# EAGLE design v1 (EAGLE 9.6.2)
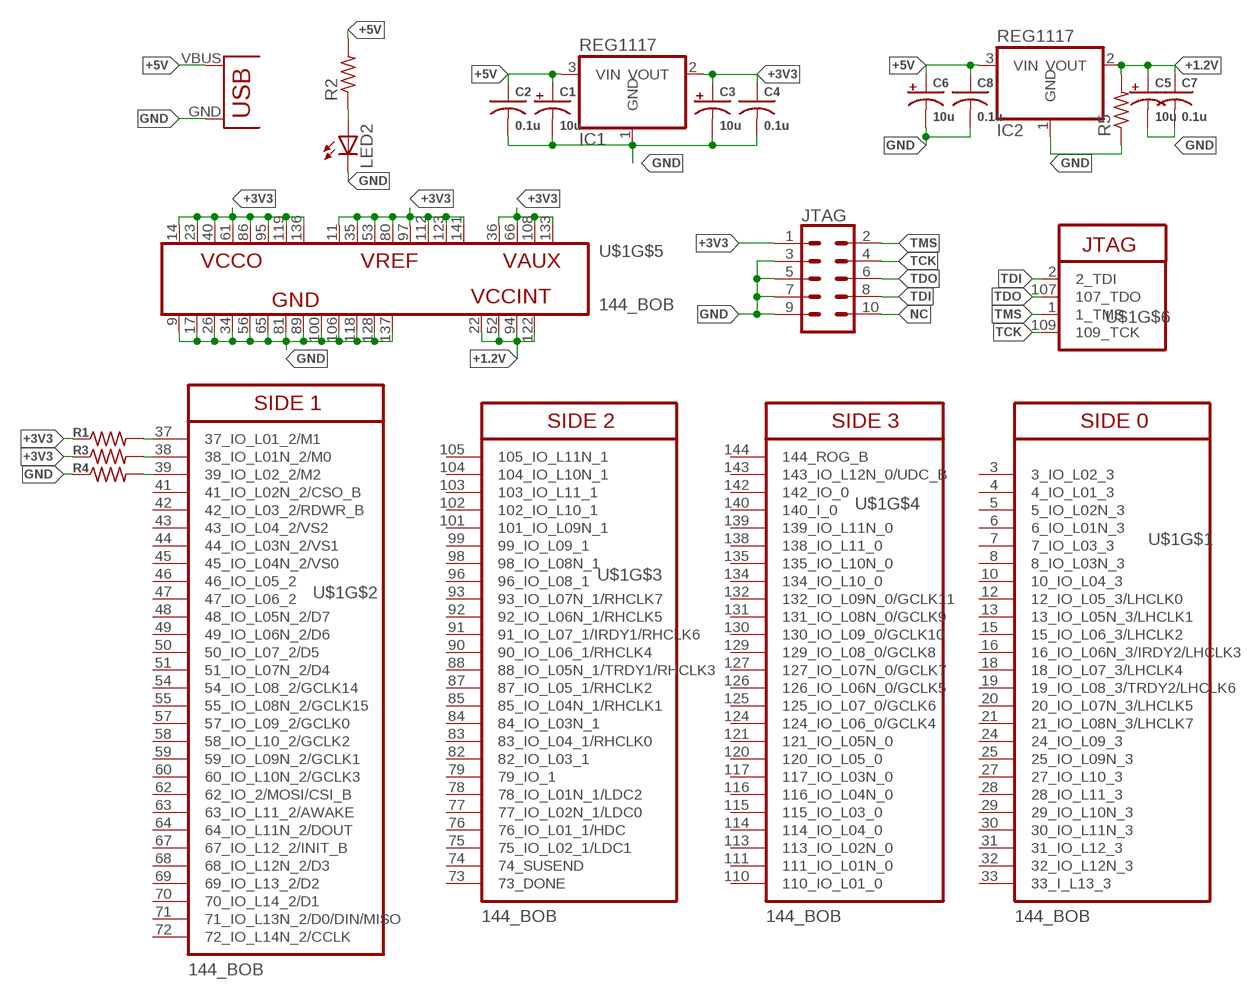
[diagram p0: schematic, sheet 1]

## Parts
C1  10u  CAP_POL_16V  [B/3528-21R]
C2  0.1u  CAP0603  [C0603]
C3  10u  CAP_POL_16V  [B/3528-21R]
C4  0.1u  CAP0603  [C0603]
C5  10u  CAP_POL_16V  [B/3528-21R]
C6  10u  CAP_POL_16V  [B/3528-21R]
C7  0.1u  CAP0603  [C0603]
C8  0.1u  CAP0603  [C0603]
IC1  REG1117  [SOT223]
IC2  REG1117  [SOT223]
JTAG  CONN_05X2  [2X5-SHROUDED_LOCK_PROPER]
LED2  LED3MM  [LED3MM]
R1  RESISTOR0805  [R0805]
R2  R-US_0204/7  [0204/7]
R3  RESISTOR0805  [R0805]
R4  RESISTOR0805  [R0805]
R5  R-US_0204/7  [0204/7]
U$1  144_BOB  [144_BOB]
U$2  USB(POWER)  [USB(POWER)]

## Nets
+1.2V: C5.+ C7.1 IC2.2(VOUT) R5.2 U$1.22(22_VCCINT) U$1.52(52_VCCINT) U$1.94(94_VCCINT) U$1.122(122_VCCINT)
+3V3: C3.+ C4.1 IC1.2(VOUT) JTAG.1 R1.1 R3.1 U$1.11(11_VREF) U$1.14(14_VCCO) U$1.23(23_VCCO) U$1.35(35_VREF) U$1.36(36_VAUX) U$1.40(40_VCCO) U$1.53(53_VREF) U$1.61(61_VCCO) U$1.66(66_VAUX) U$1.80(80_VREF) U$1.86(86_VCCO) U$1.95(95_VCCO) U$1.97(97_VREF) U$1.108(108_VAUX) U$1.112(112_VREF) U$1.119(119_VCCO) U$1.123(123_VREF) U$1.133(133_VAUX) U$1.136(136_VCCO) U$1.141(141_VREF)
+5V: C1.+ C2.1 C6.+ C8.1 IC1.3(VIN) IC2.3(VIN) R2.2 U$2.VBUS(VCC)
GND: C1.- C2.2 C3.- C4.2 C5.- C6.- C7.2 C8.2 IC1.1(GND) IC2.1(GND) JTAG.3 JTAG.5 JTAG.7 JTAG.9 LED2.K(C) R4.1 R5.1 U$1.9(9_GND) U$1.17(17_GND) U$1.26(26_GND) U$1.34(34_GND) U$1.56(56_GND) U$1.65(65_GND) U$1.81(81_GND) U$1.89(89_GND) U$1.100(100_GND) U$1.106(106_GND) U$1.118(118_GND) U$1.128(128_GND) U$1.137(137_GND) U$2.GND
N$5: R1.2 U$1.37(37_IO_L01_2/M1)
N$6: LED2.A R2.1
N$7: R3.2 U$1.38(38_IO_L01N_2/M0)
N$8: R4.2 U$1.39(39_IO_L02_2/M2)
NC: JTAG.10
TCK: JTAG.4 U$1.109(109_TCK)
TDI: JTAG.8 U$1.2(2_TDI)
TDO: JTAG.6 U$1.107(107_TDO)
TMS: JTAG.2 U$1.1(1_TMS)
Unconnected: U$1.3(3_IO_L02_3) U$1.4(4_IO_L01_3) U$1.5(5_IO_L02N_3) U$1.6(6_IO_L01N_3) U$1.7(7_IO_L03_3) U$1.8(8_IO_L03N_3) U$1.10(10_IO_L04_3) U$1.12(12_IO_L05_3/LHCLK0) U$1.13(13_IO_L05N_3/LHCLK1) U$1.15(15_IO_L06_3/LHCLK2) U$1.16(16_IO_L06N_3/IRDY2/LHCLK3) U$1.18(18_IO_L07_3/LHCLK4) U$1.19(19_IO_L08_3/TRDY2/LHCLK6) U$1.20(20_IO_L07N_3/LHCLK5) U$1.21(21_IO_L08N_3/LHCLK7) U$1.24(24_IO_L09_3) U$1.25(25_IO_L09N_3) U$1.27(27_IO_L10_3) U$1.28(28_IO_L11_3) U$1.29(29_IO_L10N_3) U$1.30(30_IO_L11N_3) U$1.31(31_IO_L12_3) U$1.32(32_IO_L12N_3) U$1.33(33_I_L13_3) U$1.41(41_IO_L02N_2/CSO_B) U$1.42(42_IO_L03_2/RDWR_B) U$1.43(43_IO_L04_2/VS2) U$1.44(44_IO_L03N_2/VS1) U$1.45(45_IO_L04N_2/VS0) U$1.46(46_IO_L05_2) U$1.47(47_IO_L06_2) U$1.48(48_IO_L05N_2/D7) U$1.49(49_IO_L06N_2/D6) U$1.50(50_IO_L07_2/D5) U$1.51(51_IO_L07N_2/D4) U$1.54(54_IO_L08_2/GCLK14) U$1.55(55_IO_L08N_2/GCLK15) U$1.57(57_IO_L09_2/GCLK0) U$1.58(58_IO_L10_2/GCLK2) U$1.59(59_IO_L09N_2/GCLK1) U$1.60(60_IO_L10N_2/GCLK3) U$1.62(62_IO_2/MOSI/CSI_B) U$1.63(63_IO_L11_2/AWAKE) U$1.64(64_IO_L11N_2/DOUT) U$1.67(67_IO_L12_2/INIT_B) U$1.68(68_IO_L12N_2/D3) U$1.69(69_IO_L13_2/D2) U$1.70(70_IO_L14_2/D1) U$1.71(71_IO_L13N_2/D0/DIN/MISO) U$1.72(72_IO_L14N_2/CCLK) U$1.73(73_DONE) U$1.74(74_SUSEND) U$1.75(75_IO_L02_1/LDC1) U$1.76(76_IO_L01_1/HDC) U$1.77(77_IO_L02N_1/LDC0) U$1.78(78_IO_L01N_1/LDC2) U$1.79(79_IO_1) U$1.82(82_IO_L03_1) U$1.83(83_IO_L04_1/RHCLK0) U$1.84(84_IO_L03N_1) U$1.85(85_IO_L04N_1/RHCLK1) U$1.87(87_IO_L05_1/RHCLK2) U$1.88(88_IO_L05N_1/TRDY1/RHCLK3) U$1.90(90_IO_L06_1/RHCLK4) U$1.91(91_IO_L07_1/IRDY1/RHCLK6) U$1.92(92_IO_L06N_1/RHCLK5) U$1.93(93_IO_L07N_1/RHCLK7) U$1.96(96_IO_L08_1) U$1.98(98_IO_L08N_1) U$1.99(99_IO_L09_1) U$1.101(101_IO_L09N_1) U$1.102(102_IO_L10_1) U$1.103(103_IO_L11_1) U$1.104(104_IO_L10N_1) U$1.105(105_IO_L11N_1) U$1.110(110_IO_L01_0) U$1.111(111_IO_L01N_0) U$1.113(113_IO_L02N_0) U$1.114(114_IO_L04_0) U$1.115(115_IO_L03_0) U$1.116(116_IO_L04N_0) U$1.117(117_IO_L03N_0) U$1.120(120_IO_L05_0) U$1.121(121_IO_L05N_0) U$1.124(124_IO_L06_0/GCLK4) U$1.125(125_IO_L07_0/GCLK6) U$1.126(126_IO_L06N_0/GCLK5) U$1.127(127_IO_L07N_0/GCLK7) U$1.129(129_IO_L08_0/GCLK8) U$1.130(130_IO_L09_0/GCLK10) U$1.131(131_IO_L08N_0/GCLK9) U$1.132(132_IO_L09N_0/GCLK11) U$1.134(134_IO_L10_0) U$1.135(135_IO_L10N_0) U$1.138(138_IO_L11_0) U$1.139(139_IO_L11N_0) U$1.140(140_I_0) U$1.142(142_IO_0) U$1.143(143_IO_L12N_0/UDC_B) U$1.144(144_ROG_B)

## Library data of the parts
C1 C3 C5 C6 = CEDT_JANUARY_2015_v5:CAP_POL
C2 C4 C7 C8 = CEDT_JANUARY_2015_v5:CAP
IC1 IC2 = CEDT_JANUARY_2015_v5:REG1117: 800mA and 1A Low Dropout (LDO) Positive Regulator 1.8V, 2.5V, 2.85V, 3.3V, 5V, and Adj
JTAG = SparkFun-Connectors_v3:CONN_05X2: Multi connection point. Often used as Generic Header-pin footprint for 0.1 inch spaced/style header connections For AVR SPI programming port, see special device with nice symbol: "AVR_SPI_PROG_5x2.dev" You can populate with any combo of single row headers, but if you'd like an exact match, check these: 2x5 AVR ICSP Male Header <https://www.sparkfun.com/products/778> (PRT-00778) 2x5 Pin Shrouded Header <https://www.sparkfun.com/products/8506> (PRT-08506) On any of the 0.1 inch spaced packages, you can populate with these: Break Away Headers - Straight <https://www.sparkfun.com/products/116> (PRT-00116) Break Away Male Headers - Right Angle <https://www.sparkfun.com/products/553> (PRT-00553) Female Headers <https://www.sparkfun.com/products/115> (PRT-00115) Break Away Headers - Machine Pin <https://www.sparkfun.com/products/117> (PRT-00117) Break Away Female Headers - Swiss Machine Pin <https://www.sparkfun.com/products/743> (PRT-00743) Special note: the shrouded connector mates well with our 5x2 ribbon cables: 2x5 Pin IDC Ribbon Cable <https://www.sparkfun.com/products/8535> (PRT-08535)
LED2 = CEDT_JANUARY_2015_v5:LED
R1 R3 R4 = CEDT_JANUARY_2015_v5:RESISTOR
R2 R5 = rcl:R-US_: RESISTOR, American symbol; SPICEPREFIX: R
U$1 = Suprio_Lib:144_BOB
U$2 = CEDT_JANUARY_2015_v5:USB(POWER)

## Net classes
0 default: width 0.406 mm
1 POWER: width 0.406 mm

## Board
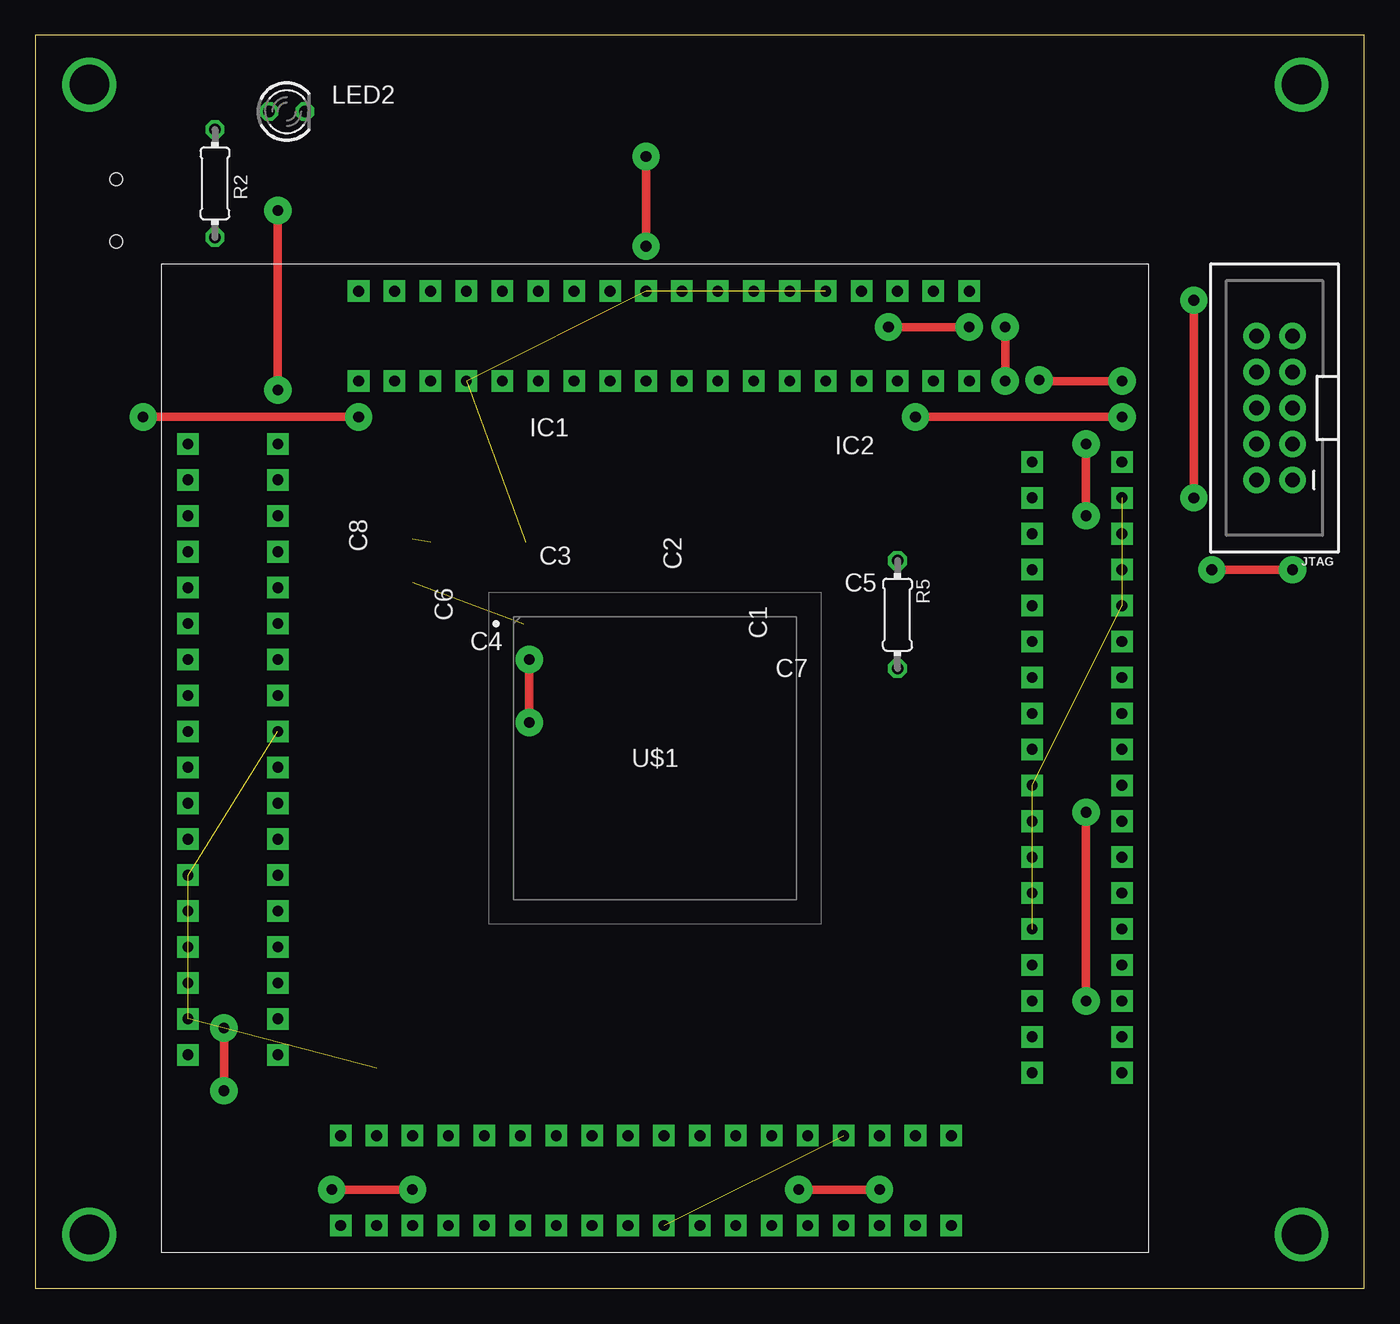
[diagram p1: board, top side]
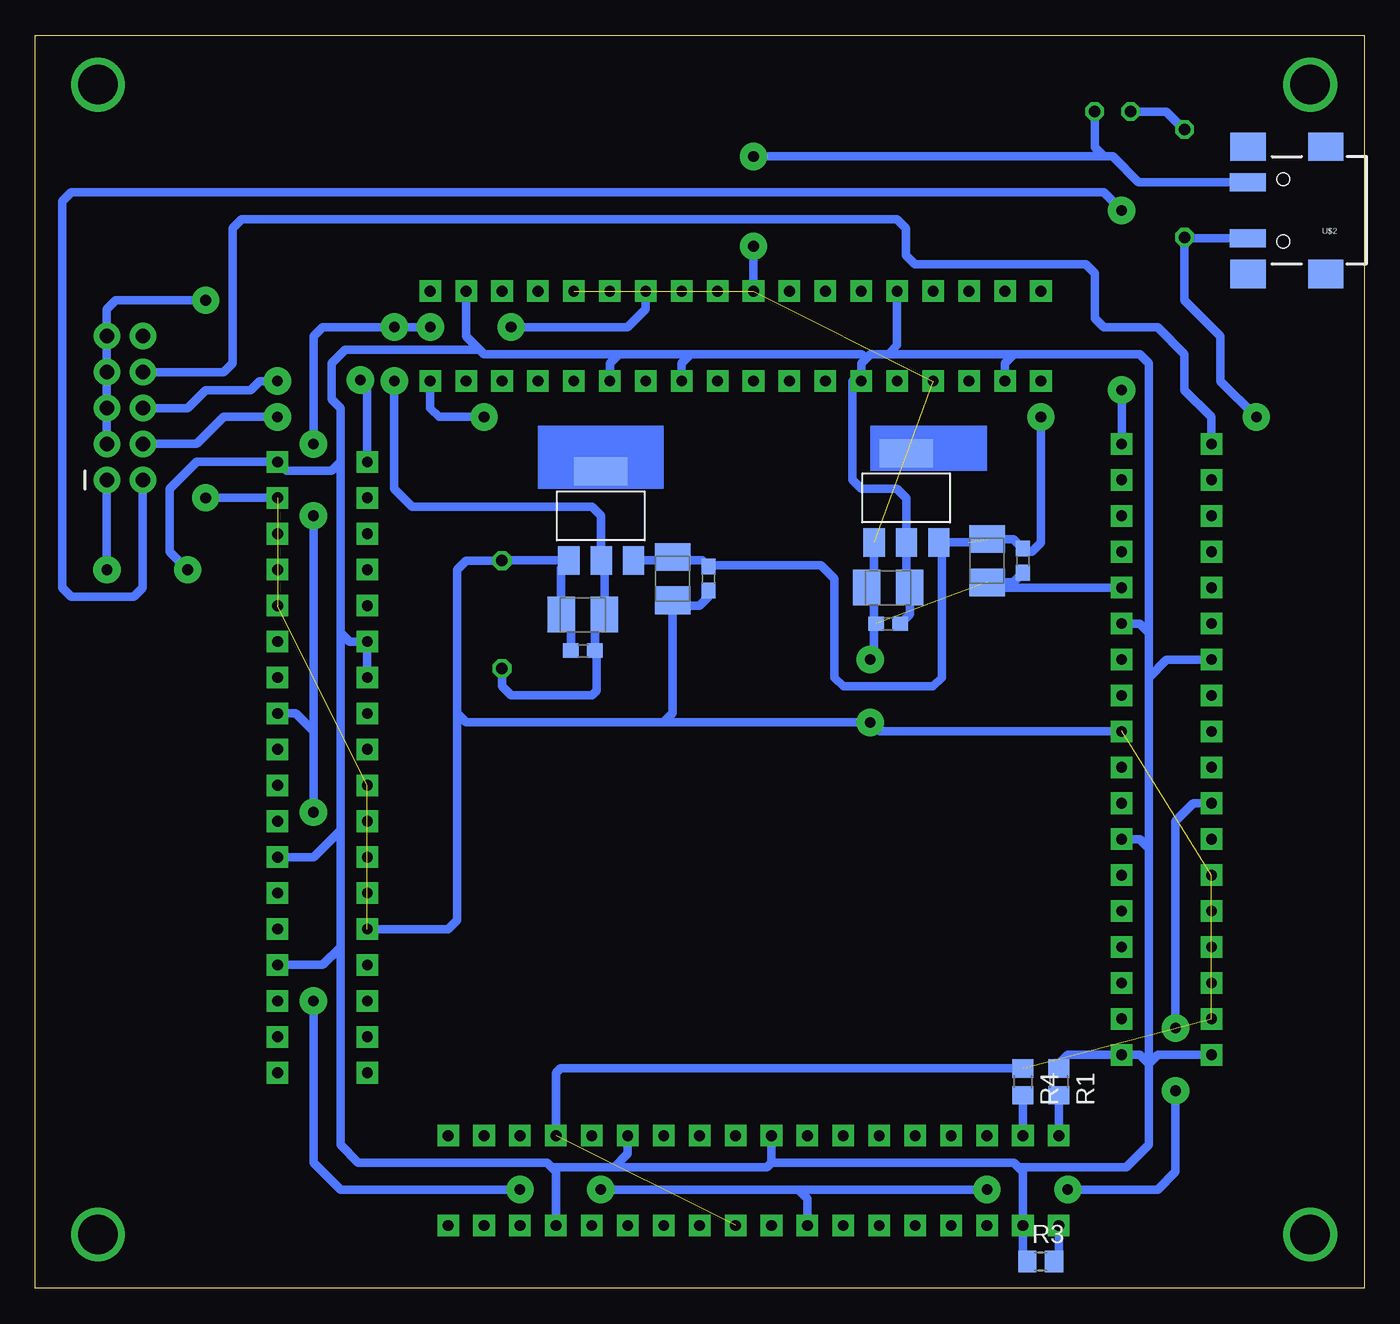
[diagram p2: board, bottom side, seen from below]

Size 93.96 x 88.57 mm. Coordinates in mm from the lower left corner, seen from the top.
Outline: 0,0 93.96,0 93.96,88.57 0,88.57 0,0
Copper layers (1*16): Top 0.035mm / dielectric 1.5mm / Bottom 0.035mm
Design rules "default": minimum track width 6mil, minimum drill 0.35mm, track to track 6mil, track to pad 6mil, pad to pad 6mil, via to via 6mil, smd to smd 6mil, copper to edge 40mil, drill to drill 6mil, minimum pad ring 10mil, minimum via ring 8mil, stop-mask expansion 4mil, vias tented up to drill 0mil, thermal gap 10mil

### Footprints (pad centres in the part's own frame; a part is rotated, then mirrored left to right if it is on the bottom)
B/3528-21R = smd 1.95 x 2.5: + 1.525,0; - -1.525,0
C0603 = smd 1.1 x 1: 1 -0.85,0; 2 0.85,0
SOT223 = smd 1.499 x 2.007: 1 -2.261,-3.15; 2 0.025,-3.15; 3 2.311,-3.15 | smd 3.81 x 2.007: 4 0,3.15
2X5-SHROUDED_LOCK_PROPER = drill 1.016 pad 1.88: 1 -1.27,5.08; 2 1.27,5.08; 3 -1.27,2.54; 4 1.27,2.54; 5 -1.27,0; 6 1.27,0; 7 -1.27,-2.54; 8 1.27,-2.54; 9 -1.27,-5.08; 10 1.27,-5.08
LED3MM = drill 0.813 octagon: A -1.27,0; K 1.27,0
R0805 = smd 1.3 x 1.5: 1 -0.95,0; 2 0.95,0
0204/7 = drill 0.813 octagon: 1 -3.81,0; 2 3.81,0
144_BOB = drill 0.762 pad 1.524 square: 1 -26.67,21.59; 2 -33.02,21.59; 3 -26.67,19.05; 4 -33.02,19.05; 5 -26.67,16.51; 6 -33.02,16.51; 7 -26.67,13.97; 8 -33.02,13.97; 9 -26.67,11.43; 10 -33.02,11.43; 11 -26.67,8.89; 12 -33.02,8.89; 13 -26.67,6.35; 14 -33.02,6.35; 15 -26.67,3.81; 16 -33.02,3.81; 17 -26.67,1.27; 18 -33.02,1.27; 19 -26.67,-1.27; 20 -33.02,-1.27; 21 -26.67,-3.81; 22 -33.02,-3.81; 23 -26.67,-6.35; 24 -33.02,-6.35; 25 -26.67,-8.89; 26 -33.02,-8.89; 27 -26.67,-11.43; 28 -33.02,-11.43; 29 -26.67,-13.97; 30 -33.02,-13.97; 31 -26.67,-16.51; 32 -33.02,-16.51; 33 -26.67,-19.05; 34 -33.02,-19.05; 35 -26.67,-21.59; 36 -33.02,-21.59; 37 -22.225,-27.305; 38 -22.225,-33.655; 39 -19.685,-27.305; 40 -19.685,-33.655; 41 -17.145,-27.305; 42 -17.145,-33.655; 43 -14.605,-27.305; 44 -14.605,-33.655; 45 -12.065,-27.305; 46 -12.065,-33.655; 47 -9.525,-27.305; 48 -9.525,-33.655; 49 -6.985,-27.305; 50 -6.985,-33.655; 51 -4.445,-27.305; 52 -4.445,-33.655; 53 -1.905,-27.305; 54 -1.905,-33.655; 55 0.635,-27.305; 56 0.635,-33.655; 57 3.175,-27.305; 58 3.175,-33.655; 59 5.715,-27.305; 60 5.715,-33.655; 61 8.255,-27.305; 62 8.255,-33.655; 63 10.795,-27.305; 64 10.795,-33.655; 65 13.335,-27.305; 66 13.335,-33.655; 67 15.875,-27.305; 68 15.875,-33.655; 69 18.415,-27.305; 70 18.415,-33.655; 71 20.955,-27.305; 72 20.955,-33.655; 73 26.67,-22.86; 74 33.02,-22.86; 75 26.67,-20.32; 76 33.02,-20.32; 77 26.67,-17.78; 78 33.02,-17.78; 79 26.67,-15.24; 80 33.02,-15.24; 81 26.67,-12.7; 82 33.02,-12.7; 83 26.67,-10.16; 84 33.02,-10.16; 85 26.67,-7.62; 86 33.02,-7.62; 87 26.67,-5.08; 88 33.02,-5.08; 89 26.67,-2.54; 90 33.02,-2.54; 91 26.67,0; 92 33.02,0; 93 26.67,2.54; 94 33.02,2.54; 95 26.67,5.08; 96 33.02,5.08; 97 26.67,7.62; 98 33.02,7.62; 99 26.67,10.16; 100 33.02,10.16; 101 26.67,12.7; 102 33.02,12.7; 103 26.67,15.24; 104 33.02,15.24; 105 26.67,17.78; 106 33.02,17.78; 107 26.67,20.32; 108 33.02,20.32; 109 22.225,26.035; 110 22.225,32.385; 111 19.685,26.035; 112 19.685,32.385; 113 17.145,26.035; 114 17.145,32.385; 115 14.605,26.035; 116 14.605,32.385; 117 12.065,26.035; 118 12.065,32.385; 119 9.525,26.035; 120 9.525,32.385; 121 6.985,26.035; 122 6.985,32.385; 123 4.445,26.035; 124 4.445,32.385; 125 1.905,26.035; 126 1.905,32.385; 127 -0.635,26.035; 128 -0.635,32.385; 129 -3.175,26.035; 130 -3.175,32.385; 131 -5.715,26.035; 132 -5.715,32.385; 133 -8.255,26.035; 134 -8.255,32.385; 135 -10.795,26.035; 136 -10.795,32.385; 137 -13.335,26.035; 138 -13.335,32.385; 139 -15.875,26.035; 140 -15.875,32.385; 141 -18.415,26.035; 142 -18.415,32.385; 143 -20.955,26.035; 144 -20.955,32.385
USB(POWER) = smd 2.54 x 1.27: GND 2.5,-1.981; VBUS 2.5,1.981 | smd 2.5 x 2: GND@1 -3,-4.5; GND@2 -3,4.5; GND@3 2.5,4.5; GND@4 2.5,-4.5 | hole 0.9: 0,2.2; 0,-2.2

### Placement (x,y rotation side)
C1  48.9,50.16 90 bottom
C2  46.35,50.16 270 bottom
C3  33.66,49.53 0 bottom
C4  33.66,46.99 180 bottom
C5  55.24,47.62 0 bottom
C6  26.67,51.44 90 bottom
C7  55.24,45.09 180 bottom
C8  24.13,51.44 270 bottom
IC1  32.38,55.88 0 bottom
IC2  53.98,54.61 0 bottom
JTAG  87.63,62.23 180 top
LED2  17.78,83.19 0 top
R1  21.59,14.61 270 bottom
R2  12.7,78.11 270 top
R3  22.86,1.91 0 bottom
R4  24.13,14.61 270 bottom
R5  60.96,47.62 270 top
U$1  43.81,38.1 0 top
U$2  5.71,76.2 180 bottom

### Tracks (layer width: path | path; a pad name or v marks a point on that pad's centre or on a via)
+1.2V  (via drill 0.75 pad 1.93)
  Top 0.61: v74.3,20.32 v74.3,33.66 | v74.3,54.61 v74.3,59.69 | v66.04,67.94 v60.33,67.94 | v53.98,6.99 v59.69,6.99 | v26.67,6.99 v20.95,6.99 | v13.34,13.97 v13.34,18.41 | v68.58,67.94 v68.58,64.14
  Bottom 0.61: v74.3,33.66 74.3,39.37 | 74.3,39.37 v74.3,54.61 | v74.3,59.69 74.3,67.31 73.66,67.94 v68.58,67.94 v66.04,67.94 | v60.33,67.94 52.07,67.94 50.8,69.22 U$1.122 | U$1.52 39.37,6.35 40.01,6.99 | 40.01,6.99 v53.98,6.99 | v59.69,6.99 72.39,6.99 74.3,8.89 v74.3,20.32 | 40.01,6.99 v26.67,6.99 | v20.95,6.99 14.61,6.99 13.34,8.26 v13.34,13.97 | v13.34,18.41 13.34,33.02 12.06,34.29 U$1.22 | IC2.2 53.98,51.44 | IC2.2 53.98,51.49 53.98,54.61 54.61,55.24 67.31,55.24 68.58,56.52 v68.58,64.14 | R5.2 60.96,42.55 60.33,41.91 54.61,41.91 54.29,42.23 54.29,44.98 C7.1 54.4,46.95 C5.+ 53.72,51.23 IC2.2 | U$1.94 75.56,40.64 74.3,39.37
+3V3  (via drill 0.75 pad 1.93)
  Top 0.61: v88.9,50.8 v83.19,50.8
  Bottom 0.61: 33.66,66.04 33.02,66.67 U$1.136 | 33.66,66.04 34.92,66.04 35.24,65.72 | 35.24,65.72 35.56,65.41 35.56,64.77 | 35.56,64.77 U$1.133 | 35.24,65.72 35.56,66.04 47.62,66.04 | 47.62,66.04 48.26,65.41 U$1.123 | 47.62,66.04 52.7,66.04 | 52.7,66.04 53.34,65.41 U$1.119 | 52.7,66.04 62.23,66.04 62.55,66.36 | 62.55,66.36 63.5,67.31 U$1.112 | 62.55,66.36 72.07,66.36 73.03,65.41 73.03,62.87 72.39,62.23 72.39,58.42 | 72.39,58.42 73.03,57.78 76.2,57.78 U$1.108 82.55,58.42 84.45,56.52 84.45,52.07 v83.19,50.8 | 72.39,58.42 72.39,46.35 | 72.39,46.35 71.75,45.72 U$1.97 U$1.95 | 72.39,46.35 72.39,32.38 | 72.39,32.38 74.3,30.48 U$1.86 | 72.39,32.38 72.39,24.13 | 72.39,24.13 73.66,22.86 U$1.80 | 72.39,24.13 72.39,10.16 71.12,8.89 57.78,8.89 57.47,8.57 | 57.47,8.57 57.15,8.26 U$1.66 | 57.47,8.57 53.02,8.57 | U$1.61 52.07,9.53 53.02,8.57 | 53.02,8.57 42.23,8.57 41.91,8.89 | U$1.53 41.91,8.89 | 24.45,8.57 24.77,8.89 41.91,8.89 | 24.45,8.57 24.13,8.26 U$1.40 24.13,2.23 R3.1 | 24.45,8.57 16.83,8.57 15.24,10.16 15.24,15.88 | 15.24,15.88 15.88,16.51 U$1.35 20.95,16.51 21.59,15.88 R1.1 | 15.24,15.88 14.61,16.51 U$1.36 | 15.24,15.88 15.24,31.11 | U$1.23 15.88,31.75 15.24,31.11 | 15.24,31.11 15.24,43.18 | 15.24,43.18 13.97,44.45 U$1.14 | 15.24,43.18 15.24,46.35 | 15.24,46.35 15.88,46.99 U$1.11 | 24.77,66.04 15.88,66.04 15.24,65.41 15.24,46.35 | 24.77,66.04 25.4,65.41 U$1.141 | 24.77,66.04 33.66,66.04 | IC1.2 32.38,52.7 | IC1.2 32.36,55.85 33.02,56.52 35.56,56.52 36.2,57.15 36.2,64.14 35.56,64.77 | IC1.2 32.36,49.76 C3.+ 32.13,47.66 C4.1 | JTAG.1 v88.9,50.8
+5V  (via drill 0.75 pad 1.93)  (1 unrouted)
  Top 0.61: v7.62,61.59 v22.86,61.59
  Bottom 0.61: 27.96,52.73 29.84,52.73 | 29.84,52.73 IC1.3 | 29.84,52.73 29.84,43.18 30.48,42.55 36.83,42.55 37.47,43.18 37.47,50.16 38.42,51.12 46.25,51.12 C2.1 46.8,51.46 48.66,51.46 | U$2.VBUS 12.62,74.22 R2.2 12.7,69.85 10.16,67.31 10.16,64.14 v7.62,61.59 | C6.+ 24.8,52.96 C8.1 23.91,52.07 23.5,52.07 22.86,52.7 v22.86,61.59 | 48.66,51.46 IC2.3 | C1.+ 48.66,51.46
GND  (via drill 0.75 pad 1.93)  (11 unrouted)
  Top 0.61: 17.46,49.21 U$1.9 | v34.92,44.45 v34.92,40.01 | v43.18,80.01 v43.18,73.66 | v81.92,69.85 v81.92,55.88
  Bottom 0.61: 34.92,52.45 IC1.1 34.65,48.9 | U$1.17 34.29,39.37 v34.92,40.01 49.53,40.01 | U$2.GND 15.95,78.18 17.78,80.01 18.41,80.01 | v43.18,73.66 U$1.128 | 18.41,80.01 v43.18,80.01 | IC2.1 56.52,51.18 | IC2.1 60.94,51.46 R5.1 63.5,51.44 64.14,50.8 64.14,40.64 | 49.53,40.01 63.5,40.01 64.14,40.64 | 64.14,40.64 64.14,26.04 64.77,25.4 U$1.81 | C8.2 24.8,49.91 C6.- 26.67,49.53 U$1.9 | C2.2 46.35,48.9 46.99,48.26 48.52,48.26 C1.- 48.9,40.64 49.53,40.01 | C5.- 56.77,48.26 | 56.77,48.26 56.77,50.93 IC2.1 | C7.2 56.09,47.59 56.77,48.26 | 34.65,48.9 34.65,47.13 | 34.65,47.13 34.65,44.73 v34.92,44.45 | C4.2 34.65,47.13 | C3.- 35.18,49.43 34.65,48.9 | JTAG.3 JTAG.5 JTAG.7 JTAG.9 88.9,69.22 88.27,69.85 v81.92,69.85 | v81.92,55.88 U$1.106 | 18.41,80.01 19.05,80.64 LED2.K | R4.1 56.84,15.55 57.15,15.24 U$1.65
N$5
  Bottom 0.61: R1.2 U$1.37
N$6
  Bottom 0.61: LED2.A 13.97,83.19 R2.1
N$7
  Bottom 0.61: R3.2 21.59,2.23 U$1.38
N$8
  Bottom 0.61: R4.2 U$1.39
N$9  (via drill 2.79 pad 3.81)
  other vias: 89.53,85.09
N$10  (via drill 2.79 pad 3.81)
  other vias: 89.53,3.81
N$11  (via drill 2.79 pad 3.81)
  other vias: 3.81,85.09
N$12  (via drill 2.79 pad 3.81)
  other vias: 3.81,3.81
TCK  (via drill 0.75 pad 1.93)
  Top 0.61: v76.83,61.59 v62.23,61.59
  Bottom 0.61: v62.23,61.59 65.41,61.59 66.04,62.23 U$1.109 | v76.83,61.59 80.64,61.59 82.55,59.69 JTAG.4
TDI
  Bottom 0.61: JTAG.8 80.64,64.77 80.01,65.41 80.01,74.93 79.38,75.56 33.02,75.56 32.38,74.93 32.38,73.03 31.75,72.39 19.68,72.39 19.05,71.75 19.05,68.58 18.41,67.94 14.61,67.94 12.7,66.04 12.7,63.5 10.79,61.59 U$1.2
TDO  (via drill 0.75 pad 1.93)
  Top 0.61: v76.83,64.14 71.05,64.14 v70.97,64.21
  Bottom 0.61: v76.83,64.14 78.11,64.14 78.74,63.5 81.92,63.5 83.19,62.23 JTAG.6 | v70.97,64.21 70.48,63.73 U$1.107
TMS  (via drill 0.75 pad 1.93)
  Top 0.61: v17.14,76.2 v17.14,63.5
  Bottom 0.61: v17.14,63.5 U$1.1 | v17.14,76.2 18.41,77.47 91.44,77.47 92.08,76.83 92.08,49.53 91.44,48.9 87,48.9 86.36,49.53 JTAG.2
(copper drawn outside any net)
  shapes: Bottom area x2